# EAGLE design p2m-001 (EAGLE 9.6.2)
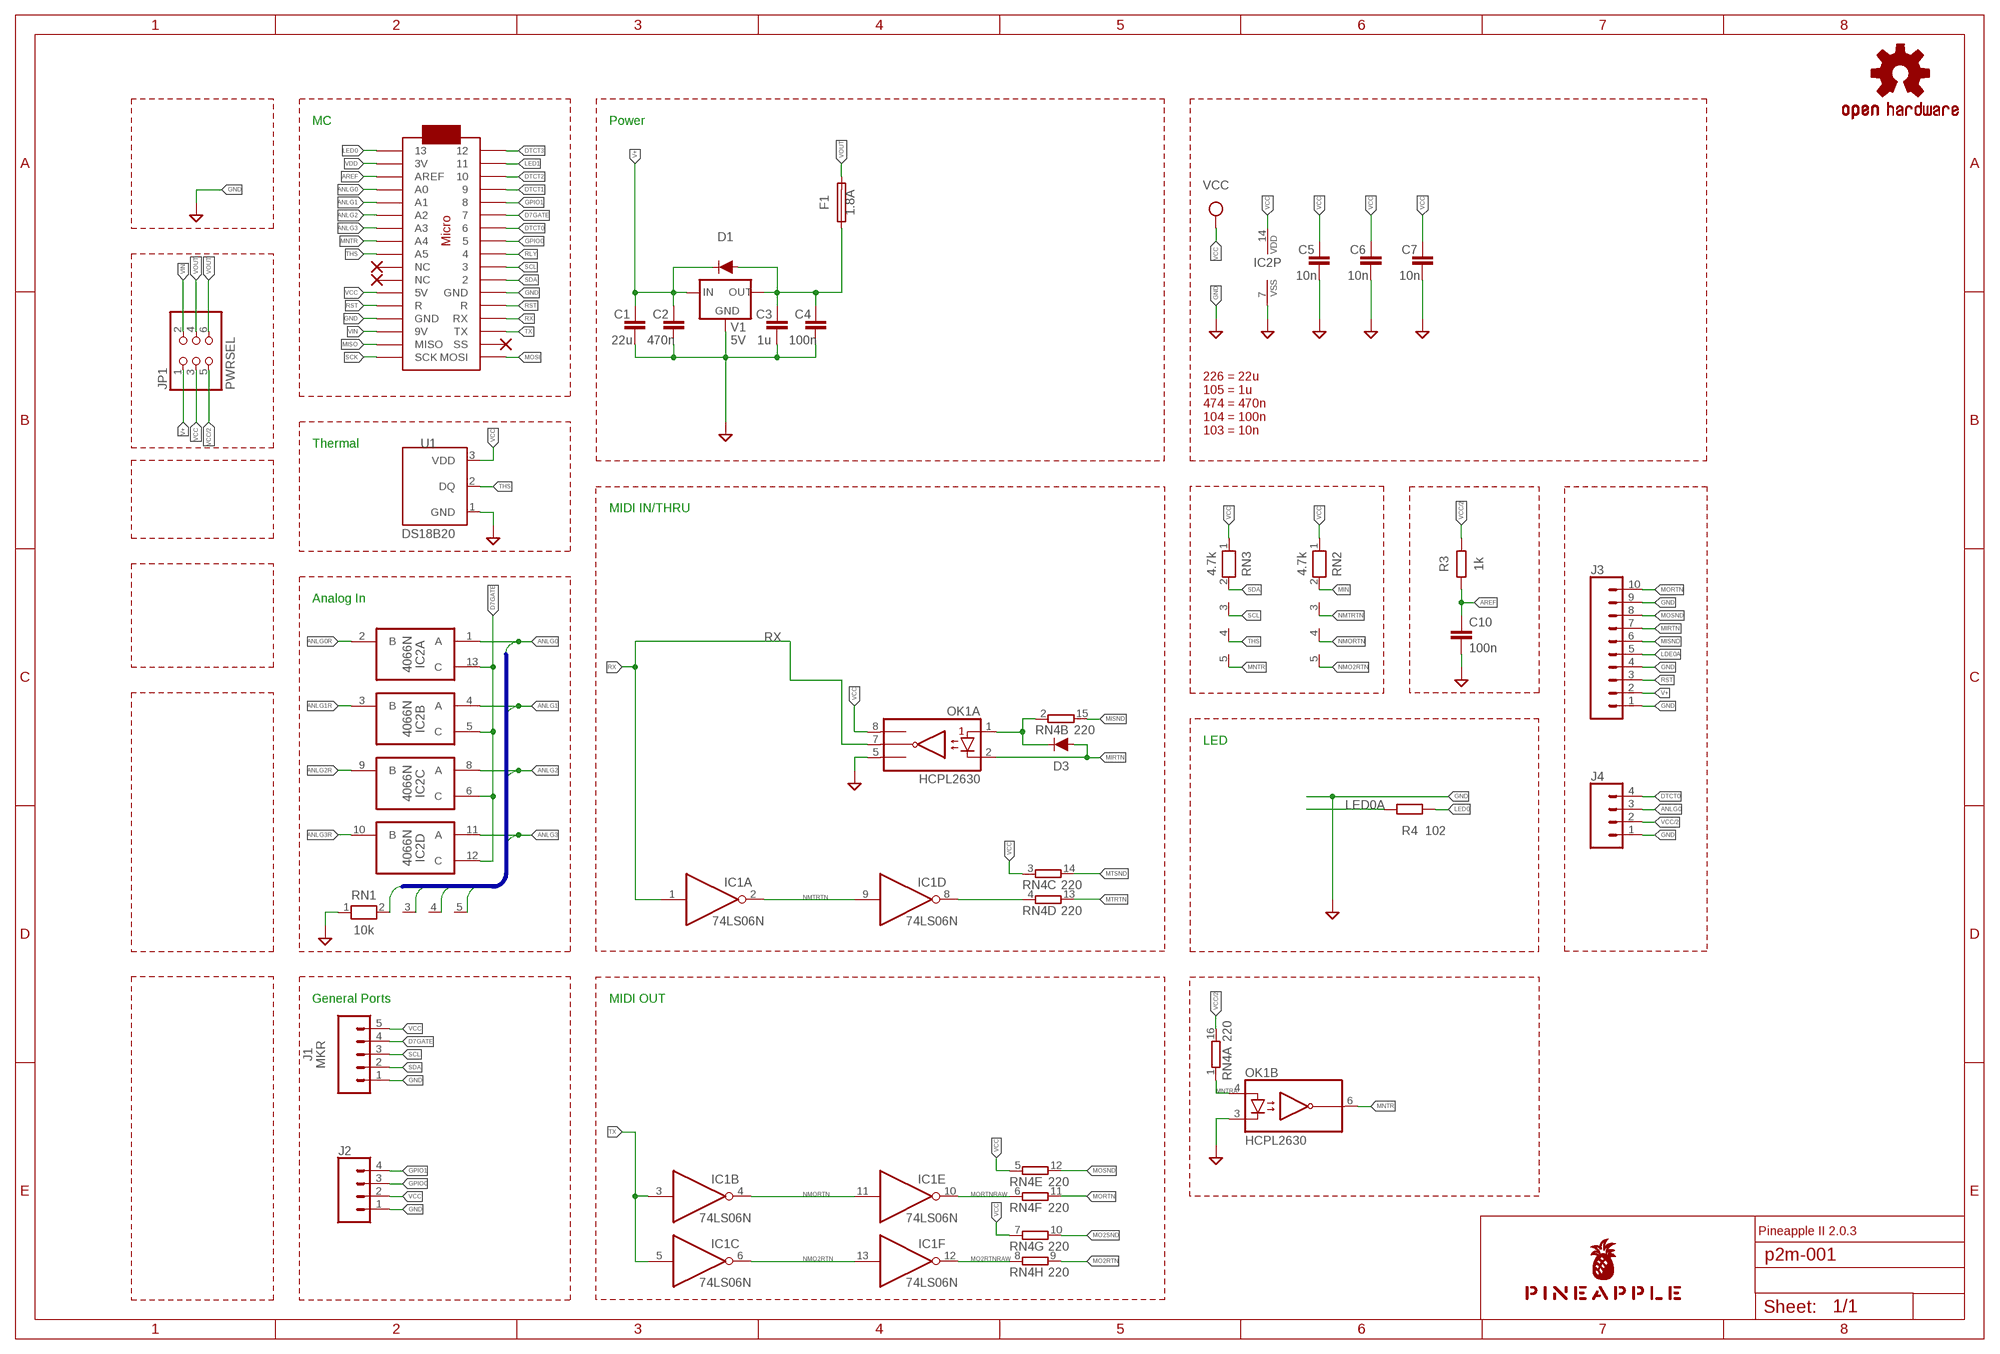
[diagram p0: schematic, sheet 1]

## Parts
C1  22u  C-EU025-050X050  [C025-050X050]
C2  470n  C-EU050-024X044  [C050-024X044]
C3  1u  C-EU050-024X044  [C050-024X044]
C4  100n  C-EU025-024X044  [C025-024X044]
C5  10n  C-EU025-024X044  [C025-024X044]
C6  10n  C-EU025-024X044  [C025-024X044]
C7  10n  C-EU025-024X044  [C025-024X044]
C10  100n  C-EU025-024X044  [C025-024X044]
D1  DIODE-1N4148  [DIODE-1N4148]
D3  DIODE-1N4148  [DIODE-1N4148]
F1  1.8A  TE5  [TE5]
IC1  74LS06N  [DIL14]
IC2  4066N  [DIL14]
J1  MKR  CONN_05JST  [JST-5-PTH]
J2  CONN_04JST-PTH  [JST-4-PTH]
J3  CONN_102MM  [1X10-2MM]
J4  CONN_04JST-PTH  [JST-4-PTH]
JP1  PWRSEL  PINHD-2X3  [2X03]
LOGO1  OSHW-LOGOS-COPPER  [OSHW-LOGO-S_COPPER]
MC1  ARDUINOMICRO  [ARDUINOMICRO]
OK1  HCPL2630  [DIL08]
R3  1k  R-EU_0204/5  [0204/5]
R4  102  R-EU_0204/5  [0204/5]
RN1  10k  RN04  [RN-5]
RN2  4.7k  RN04  [RN-5]
RN3  4.7k  RN04  [RN-5]
RN4  220  8R-N  [DIL16]
U1  DS18B20  [TO-92-AMMO]
U$1  PINEAPPLE450_SILK  [PINEAPPLE450_SILK]
V1  5V  78XXL  [78XXL]

## Nets
ANLG0 [analog]: IC2.1(A:A) J4.3 MC1.P$31(A0) RN1.2
ANLG0R [analog]: IC2.2(A:B)
ANLG1 [analog]: IC2.4(B:A) MC1.P$30(A1) RN1.3
ANLG1R [analog]: IC2.3(B:B)
ANLG2 [analog]: IC2.8(C:A) MC1.P$29(A2) RN1.4
ANLG2R [analog]: IC2.9(C:B)
ANLG3 [analog]: IC2.11(D:A) MC1.P$28(A3) RN1.5
ANLG3R [analog]: IC2.10(D:B)
AREF: C10.1 MC1.P$32(AREF) R3.1
D7GATE: IC2.5(B:C) IC2.6(C:C) IC2.12(D:C) IC2.13(A:C) J1.4 MC1.P$6
DTCT0: J4.4 MC1.P$7
DTCT1: MC1.P$4
DTCT2: MC1.P$3
DTCT3: MC1.P$1
GND [gnd]: C1.2 C2.2 C3.2 C4.2 C5.2 C6.2 C7.2 C10.2 IC2.7(P:VSS) J1.1 J2.1 J3.1 J3.4 J3.9 J4.1 MC1.P$12(GND) MC1.P$21(GND) OK1.3(B:C2) OK1.5(A:GND) RN1.1 U1.1(GND) V1.GND
GPIO0: J2.3 MC1.P$8
GPIO1: J2.4 MC1.P$5
LDE0A: J3.5
LED0: MC1.P$34 R4.2
LED0A: R4.1
LED1: MC1.P$2
MIDIINSND: D3.C OK1.1(A:A1) RN4.2
MIN: RN2.2
MIRTN [external]: D3.A J3.7 OK1.2(A:C1)
MISND [external]: J3.6 RN4.15
MISO: MC1.P$19(MISO)
MNTR: MC1.P$27(A4) OK1.6(B:VO2) RN3.5
MNTRA: OK1.4(B:A2) RN4.1
MO2RTN: RN4.9
MO2RTNRAW: IC1.12(F:O) RN4.8
MO2SND: RN4.10
MORTN: J3.10 RN4.11
MORTNRAW: IC1.10(E:O) RN4.6
MOSI: MC1.P$17(MOSI)
MOSND: J3.8 RN4.12
MTRTN: RN4.13
MTRTNRAW: IC1.8(D:O) RN4.4
MTSND: RN4.14
NMO2RTN: IC1.6(C:O) IC1.13(F:I) RN2.5
NMORTN: IC1.4(B:O) IC1.11(E:I) RN2.4
NMTRTN: IC1.2(A:O) IC1.9(D:I) RN2.3
RLY: MC1.P$9
RST: J3.3 MC1.P$13(R) MC1.P$22(R)
RX: IC1.1(A:I) MC1.P$14(RX) OK1.7(A:VO1)
SCK: MC1.P$18(SCK)
SCL: J1.3 MC1.P$10 RN3.3
SDA: J1.2 MC1.P$11 RN3.2
THS: MC1.P$26(A5) RN3.4 U1.2(DQ)
TX: IC1.3(B:I) IC1.5(C:I) MC1.P$15(TX)
V+ [superpower]: C1.1 C2.1 D1.C J3.2 JP1.1 V1.IN
VCC [power]: C5.1 C6.1 C7.1 IC2.14(P:VDD) J1.5 J2.2 JP1.3 MC1.P$23(5V) OK1.8(A:VCC) RN2.1 RN3.1 RN4.3 RN4.5 RN4.7 U1.3(VDD)
VCC/2 [superpower]: J4.2 JP1.5 R3.2 RN4.16
VDD [power]: MC1.P$33(3V)
VIN [superpower]: JP1.2 MC1.P$20(9V)
VOUT [superpower]: F1.2 JP1.4 JP1.6
VOUTRAW [superpower]: C3.1 C4.1 D1.A F1.1 V1.OUT
Unconnected: MC1.P$16(SS) MC1.P$24(NC) MC1.P$25(NC)

## Buses
ANLG[0..3]

## Notes on the sheet
- MC | Power
- 226 = 22u
  105 = 1u
  474 = 470n
  104 = 100n
  103 = 10n
- Thermal
- MIDI IN/THRU
- Analog In
- LED
- General Ports | MIDI OUT
- Pineapple II 2.0.3

## Power pins joined to a net without a drawn wire
GND: IC1.7(P:GND)
VCC: IC1.14(P:VCC)

## Library data of the parts
C1-C4 C10 = rcl:C-EU: CAPACITOR, European symbol; SPICEPREFIX: C
C5-C7 = resistor:C-EU: CAPACITOR, European symbol
D1 D3 = SparkFun-DiscreteSemi:DIODE: Diode These are standard reverse protection diodes and small signal diodes. SparkFun Products: SparkFun SparkPunk Sound Kit <https://www.sparkfun.com/products/11177> SparkFun ESP8266 Thing <https://www.sparkfun.com/products/13231>; PROD_ID: DIO-08378; VALUE: 200mA/100V/1V
F1 = fuse:TE5: FUSE Wickmann; OC_FARNELL: unknown; OC_NEWARK: unknown
IC1 = 74xx-us:74*06: Hex INVERTER, open collector high-voltage output
IC2 = 40xx:4066: Quad bilateral ANALOG SWITCH
J1 = SparkFun-Connectors:CONN_05: Multi connection point. Often used as Generic Header-pin footprint for 0.1 inch spaced/style header connections On any of the 0.1 inch spaced packages, you can populate with these: Break Away Headers - Straight <https://www.sparkfun.com/products/116> (PRT-00116) Break Away Male Headers - Right Angle <https://www.sparkfun.com/products/553> (PRT-00553) Female Headers <https://www.sparkfun.com/products/115> (PRT-00115) Break Away Headers - Machine Pin <https://www.sparkfun.com/products/117> (PRT-00117) Break Away Female Headers - Swiss Machine Pin <https://www.sparkfun.com/products/743> (PRT-00743) For SCREWTERMINALS and SPRING TERMINALS visit here: Screw Terimnals on SparkFun.com <https://www.sparkfun.com/search/results?term=Screw+Terminals> (5mm/3.5mm/2.54mm spacing) This device is also useful as a general connection point to wire up your design to another part of your project. Our various solder wires solder well into these plated through hole pads. Hook-Up Wire - Assortment (Stranded, 22 AWG) <https://www.sparkfun.com/products/11375> (PRT-11375) Hook-Up Wire - Assortment (Solid Core, 22 AWG) <https://www.sparkfun.com/products/11367> (PRT-11367) View the entire wire category on our website here <https://www.sparkfun.com/categories/141> Special notes: Molex polarized connector foot print use with SKU : PRT-08231 with associated crimp pins and housings. 1MM SMD Version SKU: PRT-10208; SF_ID: PRT-09917
J2 J4 = SparkFun-Connectors:CONN_04: Multi connection point. Often used as Generic Header-pin footprint for 0.1 inch spaced/style header connections On any of the 0.1 inch spaced packages, you can populate with these: Break Away Headers - Straight <https://www.sparkfun.com/products/116> (PRT-00116) Break Away Male Headers - Right Angle <https://www.sparkfun.com/products/553> (PRT-00553) Female Headers <https://www.sparkfun.com/products/115> (PRT-00115) Break Away Headers - Machine Pin <https://www.sparkfun.com/products/117> (PRT-00117) Break Away Female Headers - Swiss Machine Pin <https://www.sparkfun.com/products/743> (PRT-00743) For SCREWTERMINALS and SPRING TERMINALS visit here: Screw Terimnals on SparkFun.com <https://www.sparkfun.com/search/results?term=Screw+Terminals> (5mm/3.5mm/2.54mm spacing) This device is also useful as a general connection point to wire up your design to another part of your project. Our various solder wires solder well into these plated through hole pads. Hook-Up Wire - Assortment (Stranded, 22 AWG) <https://www.sparkfun.com/products/11375> (PRT-11375) Hook-Up Wire - Assortment (Solid Core, 22 AWG) <https://www.sparkfun.com/products/11367> (PRT-11367) View the entire wire category on our website here <https://www.sparkfun.com/categories/141> Special notes: Molex polarized connector foot print use with SKU : PRT-08231 with associated crimp pins and housings. 1MM SMD Version SKU: PRT-10208; PROD_ID: WIRE-13531; SF_ID: PRT-09916
J3 = SparkFun-Connectors:CONN_10: Multi connection point. Often used as Generic Header-pin footprint for 0.1 inch spaced/style header connections On any of the 0.1 inch spaced packages, you can populate with these: Break Away Headers - Straight <https://www.sparkfun.com/products/116> (PRT-00116) Break Away Male Headers - Right Angle <https://www.sparkfun.com/products/553> (PRT-00553) Female Headers <https://www.sparkfun.com/products/115> (PRT-00115) Break Away Headers - Machine Pin <https://www.sparkfun.com/products/117> (PRT-00117) Break Away Female Headers - Swiss Machine Pin <https://www.sparkfun.com/products/743> (PRT-00743) Arduino Stackable Header - 10 Pin <https://www.sparkfun.com/products/11376> (PRT-11376) For SCREWTERMINALS and SPRING TERMINALS visit here: Screw Terimnals on SparkFun.com <https://www.sparkfun.com/search/results?term=Screw+Terminals> (5mm/3.5mm/2.54mm spacing) This device is also useful as a general connection point to wire up your design to another part of your project. Our various solder wires solder well into these plated through hole pads. Hook-Up Wire - Assortment (Stranded, 22 AWG) <https://www.sparkfun.com/products/11375> (PRT-11375) Hook-Up Wire - Assortment (Solid Core, 22 AWG) <https://www.sparkfun.com/products/11367> (PRT-11367) View the entire wire category on our website here <https://www.sparkfun.com/categories/141> Special notes: Molex polarized connector foot print use with SKU : PRT-08231 with associated crimp pins and housings. 1MM SMD Version SKU: PRT-10208 NOTES ON THE VARIANTS LOCK and LOCK_LONGPADS... This footprint was designed to help hold the alignment of a through-hole component (i.e. 6-pin header) while soldering it into place. You may notice that each hole has been shifted either up or down by 0.005 of an inch from it's more standard position (which is a perfectly straight line). This slight alteration caused the pins (the squares in the middle) to touch the edges of the holes. Because they are alternating, it causes a "brace" to hold the component in place. 0.005 has proven to be the perfect amount of "off-center" position when using our standard breakaway headers. Although looks a little odd when you look at the bare footprint, once you have a header in there, the alteration is very hard to notice. Also,if you push a header all the way into place, it is covered up entirely on the bottom side.; PROD_ID: CONN-08875; SF_ID: PRT-08272
JP1 = pinhead:PINHD-2X3: PIN HEADER
LOGO1 = SparkFun-Aesthetics:OSHW-LOGO: Open-Source Hardware (OSHW) Logo This logo indicates the piece of hardware it is found on incorporates a OSHW license and/or adheres to the definition of open source hardware found here: http://freedomdefined.org/OSHW
MC1 = adafruit:ARDUINOMICRO
OK1 = optocoupler:HCPL2630: HEWLETT PACKARD OPTO COUPLER; MF: AGILENT TECHNOLOGIES; MPN: HCPL-2630-000E; OC_FARNELL: 9994904; OC_NEWARK: 88H7813
R3 R4 = resistor:R-EU_: RESISTOR, European symbol
RN1-RN3 = resistor-net:RN04: RESISTOR NETWORK; OC_FARNELL: unknown; OC_NEWARK: unknown
RN4 = resistor-dil:8R-N: DIL RESISTOR; OC_FARNELL: unknown; OC_NEWARK: unknown
U1 = SparkFun-Sensors:DS18B20: Dallas/Maxim DS18B20 1-Wire Temperature Sensor The DS18B20 reports degrees C with 9 to 12-bit precision, -55C to 125C (+/-0.5C). Each sensor has a unique 64-Bit Serial number etched into it - allows for a huge number of sensors to be used on one data bus. Datasheet <http://datasheets.maximintegrated.com/en/ds/DS18B20.pdf> SparkFun Products One Wire Digital Temperature Sensor - DS18B20 <https://www.sparkfun.com/products/245> (SEN-00245); STORE_ID: SEN-00245
U$1 = pineapple:PINEAPPLE450_SILK
V1 = v-reg:78XXL: VOLTAGE REGULATOR

## Net classes
0 default: width 0.152 mm, drill 0.152 mm, clearance 0.152 mm
1 gnd: width 0.305 mm, drill 0.152 mm, clearance 0.152 mm
2 power: width 0.508 mm, drill 0.152 mm, clearance 0.152 mm
3 analog: width 0.305 mm, drill 0.152 mm, clearance 0.152 mm
4 external: width 0.152 mm, drill 0.152 mm, clearance 0.152 mm
5 superpower: width 1.016 mm, drill 0.152 mm, clearance 0.152 mm

## Board
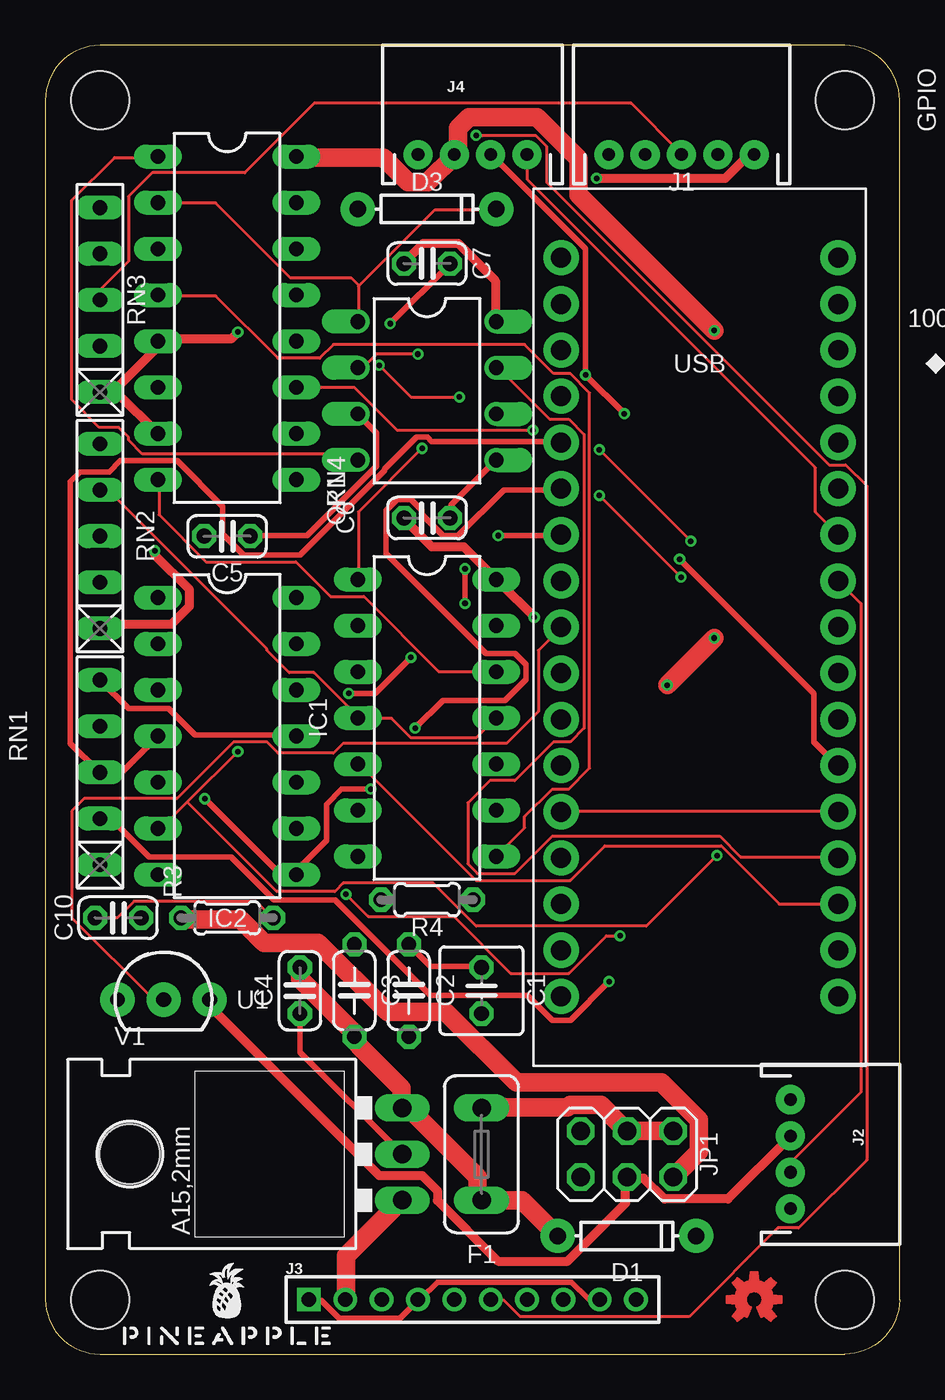
[diagram p1: board, top side]
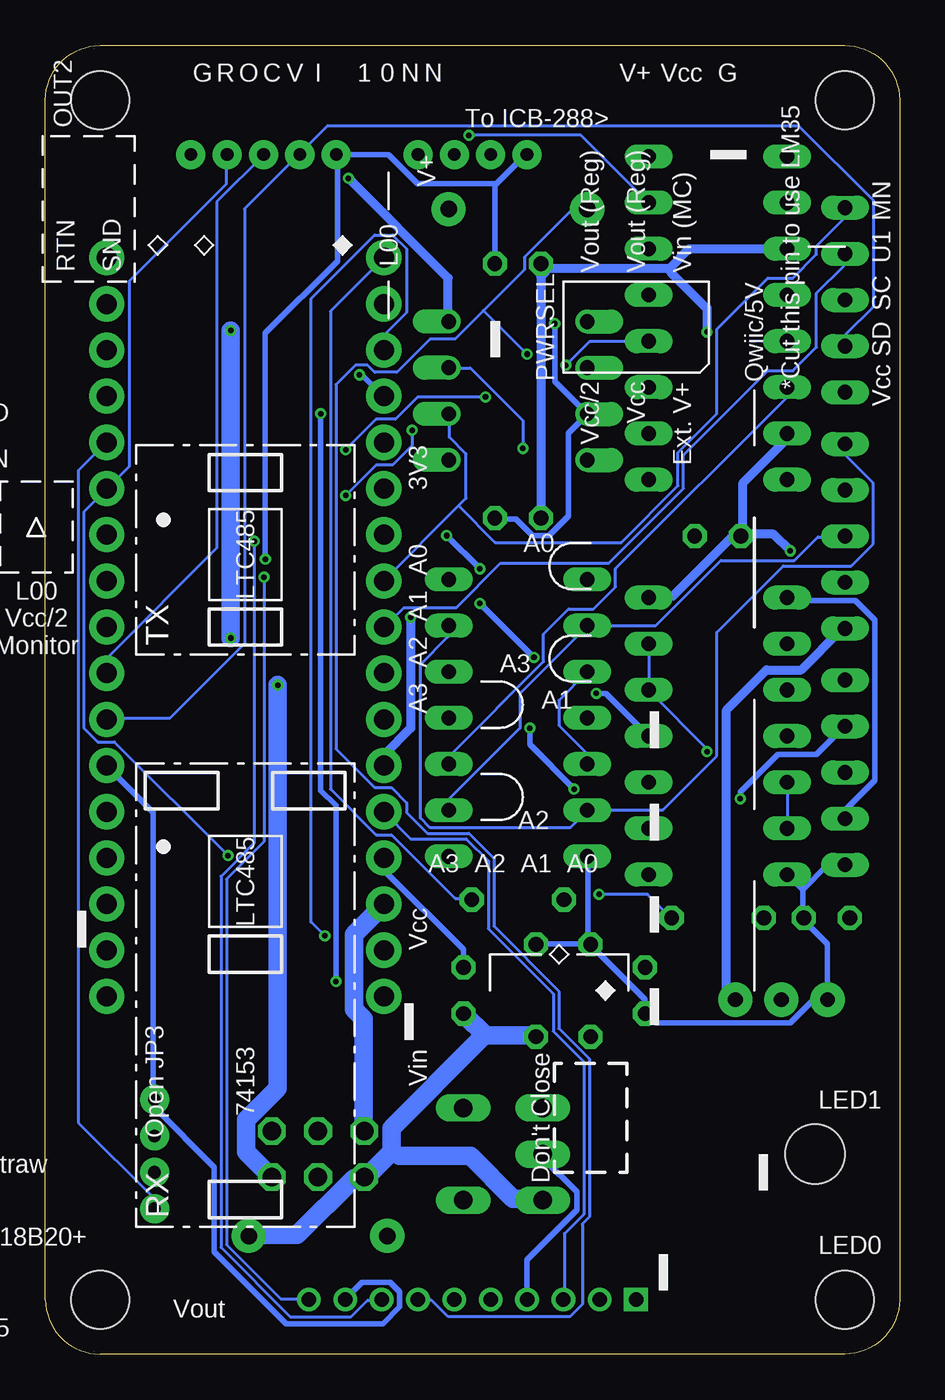
[diagram p2: board, bottom side, seen from below]

Size 47 x 72 mm. Coordinates in mm from the lower left corner, seen from the top.
Outline: 3,0 44,0 arc90 47,3 47,69 arc90 44,72 3,72 arc90 0,69 0,3 arc90 3,0
Copper layers (1*16): Top 0.035mm / dielectric 1.5mm / Bottom 0.035mm
Design rules "SeeedStudio_2layer_DRU_no_angle_20140221": minimum track width 6mil, minimum drill 12mil, track to track 6mil, track to pad 6mil, pad to pad 6mil, via to via 6mil, smd to smd 0mil, copper to edge 10mil, drill to drill 10mil, minimum pad ring 10mil, minimum via ring 6mil, stop-mask expansion 2mil, vias tented up to drill 100mil, thermal gap 10mil
Holes 3.2 mm at 3,3 3,69 44,69 44,3
tRestrict: area 0.8,66.8 to 5.2,71.2; area 0.8,0.8 to 5.2,5.2; area 41.8,66.8 to 46.2,71.2; area 41.8,0.8 to 46.2,5.2; area 0,71 to 47,72; area 0,0 to 47,1; area 0,0 to 1,72; area 46,0 to 47,72
bRestrict: area 0.8,0.8 to 5.2,5.2; area 0.8,66.8 to 5.2,71.2; area 41.8,66.8 to 46.2,71.2; area 41.8,0.8 to 46.2,5.2; area 0,71 to 47,72; area 0,0 to 47,1; area 0,0 to 1,72; area 46,0 to 47,72

### Footprints (pad centres in the part's own frame; a part is rotated, then mirrored left to right if it is on the bottom)
C025-050X050 = drill 0.813 octagon: 1 -1.27,0; 2 1.27,0
C050-024X044 = drill 0.813 octagon: 1 -2.54,0; 2 2.54,0
C025-024X044 = drill 0.813 octagon: 1 -1.27,0; 2 1.27,0
DIODE-1N4148 = drill 0.9 pad 1.88: A -3.81,0; C 3.81,0
TE5 = drill 1.016 long: 1 -2.54,0; 2 2.54,0
DIL14 = drill 0.813 long: 1 -7.62,-3.81; 2 -5.08,-3.81; 3 -2.54,-3.81; 4 0,-3.81; 5 2.54,-3.81; 6 5.08,-3.81; 7 7.62,-3.81; 8 7.62,3.81; 9 5.08,3.81; 10 2.54,3.81; 11 0,3.81; 12 -2.54,3.81; 13 -5.08,3.81; 14 -7.62,3.81
JST-5-PTH = drill 0.7 pad 1.6: 1 -4,0; 2 -2,0; 3 0,0; 4 2,0; 5 4,0
JST-4-PTH = drill 0.7 pad 1.6: 1 -3,0; 2 -1,0; 3 1,0; 4 3,0
1X10-2MM = drill 0.8 square: 1 0,0 | drill 0.8: 2 2,0; 3 4,0; 4 6,0; 5 8,0; 6 10,0; 7 12,0; 8 14,0; 9 16,0; 10 18,0
2X03 = drill 1.016 octagon: 1 -2.54,-1.27; 2 -2.54,1.27; 3 0,-1.27; 4 0,1.27; 5 2.54,-1.27; 6 2.54,1.27
ARDUINOMICRO = drill 1.1 pad 1.93: P$1 -20.32,7.62; P$2 -17.78,7.62; P$3 -15.24,7.62; P$4 -12.7,7.62; P$5 -10.16,7.62; P$6 -7.62,7.62; P$7 -5.08,7.62; P$8 -2.54,7.62; P$9 0,7.62; P$10 2.54,7.62; P$11 5.08,7.62; P$12 12.7,-7.62; P$13 10.16,-7.62; P$14 12.7,7.62; P$15 15.24,7.62; P$16 17.78,7.62; P$17 20.32,7.62; P$18 20.32,-7.62; P$19 17.78,-7.62; P$20 15.24,-7.62; P$21 7.62,7.62; P$22 10.16,7.62; P$23 7.62,-7.62; P$24 5.08,-7.62; P$25 2.54,-7.62; P$26 0,-7.62; P$27 -2.54,-7.62; P$28 -5.08,-7.62; P$29 -7.62,-7.62; P$30 -10.16,-7.62; P$31 -12.7,-7.62; P$32 -15.24,-7.62; P$33 -17.78,-7.62; P$34 -20.32,-7.62
DIL08 = drill 0.813 offset: 1 -3.81,-3.81; 2 -1.27,-3.81; 3 1.27,-3.81; 4 3.81,-3.81; 5 3.81,3.81; 6 1.27,3.81; 7 -1.27,3.81; 8 -3.81,3.81
0204/5 = drill 0.813 octagon: 1 -2.54,0; 2 2.54,0
RN-5 = drill 0.813 long: 1 -5.08,0; 2 -2.54,0; 3 0,0; 4 2.54,0; 5 5.08,0
DIL16 = drill 0.813 long: 1 -8.89,-3.81; 2 -6.35,-3.81; 3 -3.81,-3.81; 4 -1.27,-3.81; 5 1.27,-3.81; 6 3.81,-3.81; 7 6.35,-3.81; 8 8.89,-3.81; 9 8.89,3.81; 10 6.35,3.81; 11 3.81,3.81; 12 1.27,3.81; 13 -1.27,3.81; 14 -3.81,3.81; 15 -6.35,3.81; 16 -8.89,3.81
TO-92-AMMO = drill 0.813 pad 1.88: 1 -2.54,0; 2 0,0; 3 2.54,0
78XXL = drill 1.016 long: GND 0,-3.81; IN -2.54,-3.81; OUT 2.54,-3.81 | hole 3.302: 0,11.176

### Placement (x,y rotation side)
C1  24,20 90 top
C2  20,20 90 top
C3  17,20 90 top
C4  14,20 270 top
C5  10,45 0 top
C6  21,46 0 top
C7  21,60 0 top
C10  4,24 0 top
D1  32,6.5 0 top
D3  21,63 0 top
F1  24,11 90 top
IC1  21,35 270 top
IC2  10,34 270 top
J1  35,66 0 top
J2  41,11 270 top
J3  14.5,3 0 top
J4  23.5,66 0 top
JP1  32,11 0 top
LOGO1  39,3 0 top
MC1  36,40 270 top
OK1  21,53 270 top
R3  10,24 180 top
R4  21,25 0 top
RN1  3,32 90 top
RN2  3,45 90 top
RN3  3,58 90 top
RN4  10,57 270 top
U1  6.5,19.5 0 top
U$1  10,0.5 0 top
V1  15.82,11 90 top

### Tracks (layer width: path | path; a pad name or v marks a point on that pad's centre or on a via)
ANLG0  (via drill 0.3)
  Top 0.305: J4.3 24.54,65.99 29.72,60.81 v29.72,53.87 v31.85,51.74 | v31.01,20.5 28.88,18.36 27.89,18.36 26.52,19.74 21.18,19.74 15.93,24.99 12.57,24.99 10.21,27.36 5.71,27.36 3.66,29.41 3.05,29.41 RN1.2
  Bottom 0.305: RN1.2 2.97,29.49 2.97,29.95 1.37,31.55 1.37,40.39 2.44,41.45 6.02,41.45 6.17,41.6 IC2.1 | v29.72,53.87 29.57,53.87 28.42,52.73 MC1.P$31 | v31.01,20.5 31.01,30.18 31.85,31.01 v31.85,51.74
ANLG1
  Top 0.305: IC2.4 6.17,33.98 4.19,32 3.05,32 RN1.3 2.9,32.08 1.37,33.6 1.37,48.01 1.91,48.54 3.5,48.54 4.12,49.15 7.24,49.15 9.75,46.63 9.75,45.11 10.9,43.97 14.02,43.97 18.67,48.62 18.67,48.69 20.42,50.44 21.03,50.44 21.26,50.22 28.35,50.22 MC1.P$30
ANLG2  (via drill 0.3)
  Top 0.305: v8.76,30.56 12.88,26.44 13.79,26.44 IC2.8 13.79,26.59 15.47,28.27 15.47,30.25 16.31,31.09 v17.91,31.09 | v20.34,34.44 21.87,35.97 25.3,35.97 26.44,37.11 26.44,37.95 25.83,38.56 24.23,38.56 18.75,44.04 18.75,46.41 19.36,47.02 20.12,47.02 20.73,46.41 20.73,46.18 21.87,45.03 22.71,45.03 25.22,47.55 28.35,47.55 MC1.P$29
  Bottom 0.305: v8.76,30.56 8.76,30.94 6.71,32.99 4.57,32.99 3.05,34.52 RN1.4 | v20.34,34.44 20.34,33.53 v17.91,31.09
ANLG3  (via drill 0.3)
  Top 0.305: IC2.11 13.79,34.06 8.23,34.06 6.78,35.51 4.57,35.51 3.05,37.03 RN1.5 | v24.92,45.03 28.35,45.03 MC1.P$28 | v23.09,41.3 v23.09,43.2 | v20.12,38.33 18.14,36.35 v16.69,36.35
  Bottom 0.305: v23.09,43.2 v24.92,45.03 | v20.12,38.33 v23.09,41.3 | v16.69,36.35 16.15,36.35 13.87,34.06 IC2.11
AREF  (via drill 0.3)
  Top 0.152: C10.1 2.74,24 3.96,24 4.88,24.92 11.58,24.92 12.5,24 R3.1 | v31.62,23.01 30.86,23.01 28.8,20.95 25.6,20.95 22.48,24.08 17.75,24.08 v16.54,25.3
  Bottom 0.152: v31.62,23.01 32.38,23.77 32.38,58.06 28.88,61.57 27.89,61.57 27.13,60.81 27.13,57.3 28.35,56.08 28.35,55.24 MC1.P$32 | v16.54,25.3 13.87,25.3 12.57,24 R3.1
D7GATE  (via drill 0.3)
  Top 0.152: v10.59,33.15 7.81,30.37 | 7.81,30.37 6.4,28.96 6.25,28.96 IC2.6 | 7.81,30.37 12.72,25.45 15.93,25.45 16.38,25.91 21.34,25.91 23.7,23.55 33.07,23.55 v36.96,27.43
  Bottom 0.152: IC2.6 6.17,28.96 6.17,31.39 IC2.5 | IC2.13 13.79,39.01 13.79,36.58 IC2.12 13.79,36.5 10.59,33.3 v10.59,33.15 | J1.4 37.03,65.99 37.03,64.39 42.37,59.05 42.37,48.84 43.59,47.62 MC1.P$6 43.66,47.55 44.88,46.33 44.88,34.44 44.12,33.68 43.2,33.68 v36.96,27.43
DTCT0
  Top 0.152: J4.4 26.52,65.99 26.52,64.62 42.37,48.77 42.37,46.33 43.59,45.11 MC1.P$7
GND  (via drill 0.3)
  Top 0.305: C6.2 22.33,46.02 22.33,46.71 24.77,49.15 OK1.5 | C5.2 11.28,45.03 14.4,45.03 18.21,48.84 18.21,50.67 17.22,51.66 OK1.3 | v18.97,56.69 22.25,59.97 C7.2 | C1.2 23.93,21.34 21.18,21.34 20.04,22.48 C2.2 | J3.1 14.55,2.97 15.16,2.97 16.15,1.98 19.51,1.98 20.5,2.97 J3.4 20.65,3.05 21.57,3.96 28.96,3.96 29.87,3.05 30.48,3.05 J3.9 | C4.2 14.02,18.67 14.02,16.61 19.58,11.05 V1.GND | v34.9,43.74 42.29,36.35 42.29,33.68 43.59,32.38 MC1.P$21
  Bottom 0.305: 22.25,64.31 22.25,60.05 C7.2 | 22.25,64.31 20.57,65.99 J4.1 | 22.25,64.31 22.33,64.39 26.52,64.39 28.12,65.99 30.94,65.99 J1.1 30.94,65.84 30.94,60.12 34.9,56.16 v34.9,43.74 | C6.2 22.25,45.95 21.11,45.95 20.19,45.03 19.28,45.03 18.21,46.1 18.21,50.67 17.22,51.66 OK1.3 17.3,51.82 18.97,53.49 v18.97,56.69 | 5.33,25.53 5.33,24 C10.2 5.26,23.85 3.96,22.55 U1.1 4.12,19.51 4.72,19.51 6.02,18.21 13.41,18.21 13.87,18.67 C4.2 14.02,18.75 14.02,19.51 16.99,22.48 C3.2 | 5.33,25.53 6.17,26.36 IC2.7 | 5.33,25.53 3.96,26.9 3.05,26.9 RN1.1 | C2.2 19.96,22.55 17.14,22.55 C3.2 | IC1.7 17.14,27.36 17.14,22.71 C3.2 | MC1.P$12 28.35,27.28 28.35,26.59 24,22.25 24,21.34 C1.2 | MC1.P$21 43.59,32.31 41.07,29.79 41.07,14.02 J2.1 41,13.87 41,13.56 37.72,10.29 37.72,5.64 33.76,1.68 28.42,1.68 27.51,2.59 27.51,3.43 28.04,3.96 29.57,3.96 30.48,3.05 J3.9 | V1.GND 19.58,10.97 19.58,10.74 17.75,8.91 17.75,7.92 20.5,5.18 20.5,3.05 J3.4
GPIO0
  Top 0.152: J2.3 41.07,10.06 41.07,10.59 44.88,14.4 44.88,41.3 43.66,42.52 MC1.P$8
GPIO1
  Bottom 0.152: J2.4 41.07,8 41.07,8.61 45.19,12.72 45.19,48.62 43.66,50.14 MC1.P$5
LED0
  Bottom 0.152: R4.2 23.55,25.07 24.46,25.07 27.96,28.57 28.8,28.57 31.32,31.09 31.32,57.38 28.42,60.27 MC1.P$34
MIDIINSND
  Top 0.152: 17.26,58.79 21.41,62.94 24.77,62.94 D3.C | 17.26,58.79 17.22,58.75 17.22,56.84 OK1.1 | 17.26,58.79 16.84,59.21 13.49,59.21 9.37,63.32 6.25,63.32 RN4.2
MIRTN  (via drill 0.3)
  Top 0.152: v20.5,55.02 18.21,55.02 17.53,54.33 17.22,54.33 OK1.2
  Bottom 0.152: 22.9,57.42 20.65,59.66 20.65,60.35 18.06,62.94 17.22,62.94 D3.A | 22.9,57.42 24.46,55.85 25.83,55.85 27.66,54.03 28.88,54.03 29.26,54.41 29.95,54.41 31.01,53.34 31.01,33.3 28.88,31.17 27.96,31.17 27.13,30.33 27.13,29.79 25.98,28.65 23.7,28.65 22.33,27.28 22.33,23.55 18.75,19.96 18.75,17.91 17.07,16.23 17.07,7.54 17.45,7.16 17.45,2.74 18.14,2.06 24.84,2.06 25.76,2.97 26.44,2.97 J3.7 | 22.9,57.42 v20.5,55.02
MISND  (via drill 0.3)
  Top 0.152: v23.7,67.06 26.98,67.06 27.58,66.45 27.58,64.47 43.13,48.92 44.04,48.92 45.19,47.78 45.19,10.67 41.45,6.93 40.31,6.93 35.43,2.06 26.14,2.06 25.22,2.97 24.54,2.97 J3.6
  Bottom 0.152: v23.7,67.06 17.53,67.06 13.87,63.4 RN4.15
MNTR
  Bottom 0.152: 24.27,46.67 28.35,42.6 MC1.P$27 | 24.27,46.67 23.85,47.09 23.85,49.53 24.77,50.44 24.77,51.66 OK1.6 | 24.27,46.67 22.25,44.65 15.32,44.65 12.19,47.78 12.19,49.61 10.06,51.74 10.06,56.39 7.24,59.21 5.87,59.21 4.57,60.5 4.57,60.96 3.05,62.48 3.05,63.02 RN3.5
MNTRA
  Top 0.152: RN4.1 6.17,65.84 3.81,65.84 1.45,63.48 1.45,52.5 2.97,50.98 4.04,50.98 4.57,50.44 4.57,50.29 5.33,49.53 16.84,49.53 17.14,49.23 OK1.4
MO2RTNRAW
  Top 0.152: IC1.12 24.77,37.57 21.64,37.57 17.53,41.68 15.7,41.68 13.79,43.59 8.84,43.59 6.25,46.18 6.25,48.08 RN4.8
MORTN  (via drill 0.3)
  Top 0.152: v30.48,47.24 v34.98,42.75 | v26.82,50.83 19.36,50.83 16.99,53.19 13.87,53.19 RN4.11
  Bottom 0.152: v34.98,42.75 34.98,28.19 37.03,26.14 37.03,6.02 34.06,3.05 32.54,3.05 J3.10 | v30.48,47.24 28.8,48.92 27.89,48.92 26.82,49.99 v26.82,50.83
MORTNRAW
  Bottom 0.152: RN4.6 6.25,53.19 6.25,52.58 15.62,43.2 15.62,42.22 16.84,41 18.21,41 19.58,39.62 19.58,38.1 24.77,32.92 24.77,32.46 IC1.10
MOSND  (via drill 0.3)
  Top 0.152: v30.48,49.76 v35.51,44.73 | v22.78,52.65 20.12,52.65 v18.36,54.41
  Bottom 0.152: v35.51,44.73 35.51,28.12 37.34,26.29 37.34,5.87 33.53,2.06 30.18,2.06 29.26,2.97 28.57,2.97 J3.8 | v30.48,49.76 28.8,51.44 27.74,51.44 26.52,52.65 v22.78,52.65 | v18.36,54.41 17.07,55.7 13.87,55.7 RN4.12
MTRTNRAW
  Top 0.152: RN4.4 6.25,58.22 9.37,58.22 12.8,54.79 15.09,54.79 15.85,55.55 26.36,55.55 27.96,53.95 28.88,53.95 29.95,52.88 29.95,32.23 28.8,31.09 27.89,31.09 26.36,29.57 26.36,28.96 24.84,27.43 IC1.8
NMO2RTN
  Bottom 0.152: RN2.5 2.97,50.06 2.97,49.45 1.45,47.93 1.45,44.58 2.67,43.36 6.4,43.36 10.06,39.7 10.06,32.92 13.03,29.95 17.14,29.95 IC1.6 17.22,29.87 18.14,28.96 25.83,28.96 26.36,29.49 26.36,37.95 24.84,39.47 24.84,40.01 IC1.13
NMORTN
  Top 0.152: IC1.11 24.77,34.98 23.7,33.91 20.12,33.91 19.05,34.98 17.22,34.98 IC1.4 17.22,35.05 14.78,37.49 13.41,37.49 12.19,38.71 12.19,38.79 3.5,47.47 3.05,47.47 RN2.4
NMTRTN
  Bottom 0.152: IC1.9 24.77,29.95 24.77,30.56 20.88,34.44 20.88,36.35 17.22,40.01 IC1.2 17.14,40.08 13.41,40.08 9.83,43.66 5.79,43.66 4.5,44.96 3.05,44.96 RN2.3
RST
  Top 0.152: MC1.P$22 43.59,29.87 28.42,29.87 MC1.P$13
  Bottom 0.152: J3.3 18.44,3.05 18.44,6.63 17.37,7.7 17.37,16.08 19.05,17.75 19.05,19.81 22.63,23.39 22.63,27.13 23.85,28.35 26.9,28.35 28.35,29.79 MC1.P$13
RX  (via drill 0.3)
  Top 0.152: v20.73,49.84 17.22,46.33 17.22,42.67 IC1.1 | MC1.P$14 43.59,27.36 38.25,27.36 37.11,28.5 27.89,28.5 25.83,26.44 23.77,26.44 23.24,26.98 23.24,30.33 24.46,31.55 25.83,31.55 27.96,33.68 28.88,33.68 29.64,34.44 29.64,50.6 28.8,51.44 27.74,51.44 24.84,54.33 OK1.7
  Bottom 0.152: v20.73,49.84 20.73,51.36 23.62,54.25 24.77,54.25 OK1.7
SCL
  Top 0.152: RN3.3 3.05,58.06 3.05,58.6 4.57,60.12 4.57,63.7 5.87,65 10.97,65 14.78,68.81 32.23,68.81 34.98,66.06 J1.3
  Bottom 0.152: MC1.P$10 43.59,37.49 43.59,38.33 37.57,44.35 37.57,63.4 34.98,65.99 J1.3
SDA
  Bottom 0.152: RN3.2 2.97,55.47 2.97,56.08 1.45,57.61 1.45,63.48 5.56,67.59 31.47,67.59 32.99,66.06 J1.2 33.07,65.99 36.04,63.02 36.04,39.09 40.16,34.98 43.59,34.98 MC1.P$11
THS
  Top 0.152: U1.2 6.48,19.51 5.94,19.51 1.45,24 1.45,29.87 2.13,30.56 7.24,30.56 10.36,33.68 12.19,33.68 12.8,33.07 15.85,33.07 16.38,33.6 25.38,33.6 27.13,35.36 27.13,38.71 28.35,39.93 MC1.P$26
  Bottom 0.152: RN3.4 3.05,60.5 3.05,59.89 4.57,58.37 4.57,55.4 5.87,54.1 7.24,54.1 11.89,49.45 11.89,47.62 16,43.51 21.95,43.51 24.38,41.07 27.28,41.07 28.35,40.01 MC1.P$26
TX
  Top 0.152: MC1.P$15 43.59,24.77 40.39,24.77 37.19,27.96 30.79,27.96 28.88,26.06 23.7,26.06 17.37,32.38 17.22,32.38 IC1.5
  Bottom 0.152: IC1.5 17.22,32.46 17.22,33.07 18.75,34.59 18.75,35.97 17.22,37.49 IC1.3
V+
  Top 1.016: J3.2 16.54,3.05 16.54,5.41 19.58,8.46 V1.IN
  Bottom 1.016: 22.78,17.53 20.04,17.53 C2.1 | 22.78,17.53 23.93,18.67 C1.1 | D1.C 35.74,6.55 33.15,6.55 30.02,9.68 29.49,9.68 JP1.1 29.03,10.06 27.96,11.12 | 27.96,11.12 27.96,12.42 23.16,17.22 22.78,17.53 | V1.IN 19.66,8.53 21.26,8.53 23.62,10.9 27.51,10.9 27.96,11.12
VCC  (via drill 0.3)
  Top 0.508: RN4.7 6.17,50.67 3.96,52.88 3.05,52.88 RN3.1 3.89,53.11 6.17,55.4 6.17,55.7 RN4.5 6.4,55.85 10.21,55.85 v10.59,56.24 | C6.1 19.74,45.95 21.26,44.42 23.01,44.42 24.77,42.67 IC1.14 24.99,42.44 v26.9,40.54 | OK1.8 24.77,56.84 24.77,59.05 22.71,61.11 20.8,61.11 19.74,60.05 C7.1 | v30.33,64.69 37.41,64.69 38.71,65.99 38.94,65.99 J1.5 | J2.2 41,11.96 37.57,8.53 34.06,8.53 32.92,9.68 32,9.68 JP1.3 31.93,9.45 31.93,8.31 28.73,5.11 24.92,5.11 21.57,8.46 21.57,8.99 20.73,9.83 18.36,9.83 9.07,19.13 9.07,19.43 U1.3 | v6.02,44.2 6.02,43.97 7.92,42.06 7.92,41.15 6.93,40.16 3.28,40.16 3.05,39.93 RN2.1
  Bottom 0.508: IC2.14 13.79,41.68 12.5,41.68 9.22,44.96 8.76,44.96 C5.1 | RN4.7 6.25,50.6 6.25,50.29 8.61,47.93 8.61,45.19 C5.1 | v26.9,40.54 26.9,34.44 28.35,32.99 28.35,32.38 MC1.P$23 | 12.65,59.74 11.58,60.81 6.25,60.81 RN4.3 | 12.65,59.74 19.43,59.74 19.66,59.97 C7.1 19.51,59.51 19.74,59.28 19.74,46.02 C6.1 | v30.33,64.69 24.84,59.21 24.84,56.84 OK1.8 | v10.59,56.24 10.59,57.53 12.57,59.51 12.65,59.74 | RN2.1 3.05,39.85 3.2,39.85 5.41,37.64 7.32,37.64 9.53,35.43 9.53,19.96 9.07,19.51 U1.3 | v6.02,44.2 6.93,45.11 8.38,45.11 C5.1
VCC/2  (via drill 0.3)
  Top 1.016: RN4.16 13.87,65.84 18.59,65.84 19.96,64.47 21.03,64.47 22.55,65.99 J4.2 22.71,66.45 22.71,67.44 23.32,68.05 27.05,68.05 29.34,65.76 29.34,63.78 v36.8,56.31 | R3.2 7.47,23.93 10.74,23.93 12.04,22.63 15.01,22.63 18.82,18.82 22.02,18.82 25.91,14.94 33.91,14.94 35.97,12.88 35.97,11.12 34.59,9.75 JP1.5 | v34.21,36.8 v36.8,39.4
  Bottom 1.016: v36.8,39.4 v36.8,56.31 | v34.21,36.8 34.21,14.63 35.97,12.88 35.97,11.12 34.59,9.75 JP1.5
VIN
  Bottom 1.016: JP1.2 29.49,12.34 29.49,18.44 30.02,18.97 30.02,23.09 28.42,24.69 MC1.P$20
VOUT
  Top 1.016: JP1.6 34.52,12.27 JP1.4 31.62,12.65 30.56,13.72 28.88,13.72 28.73,13.56 24,13.56 F1.2
VOUTRAW
  Top 1.016: D1.A 28.12,6.55 26.21,8.46 F1.1 23.77,8.91 23.77,9.75 20.12,13.41 V1.OUT 19.58,13.56 19.58,14.63 17.22,16.99 C3.1 16.99,17.53 16.99,17.68 14.02,20.65 14.02,21.26 C4.1

### Text on the board
tNames: GPIO (5V) | GPIO | Pineapple IIm | 0.0.1-X | GND | MNTR | 1k | MKR | 100n | 4.7k | USB | 221 | 102 | MNTR | 102 | TLP2630 | 74LS06 | 4066B | BackPort II | LED | 100n | Arduino Micro | 100n | 47k | 470n | 10k | 4.7k | 5V1.5A | 1k | 1A | C1815 | 1u | MC1 | Pineapple Computer (2022) | DS18B20+
bNames: G | Vcc | V+ | N | N | 0 | 1 | I | V | C | O | R | G | G | V | G0 | G1 | To ICB-288> | OUT2 | V+ | GND | MN | GND | JP3 | U1 | *Cut this pin to use LM35 | L00 | SND | RTN | SDA | Vin (MC) | Vout (Reg) | Vout (Reg) | SCL | SC | D7 | SD | PWRSEL | Close | Vcc | Qwiic/5V | Ext. V+ | Vcc | Vcc/2 | Vcc | SND | 3V3 | RTN | PWRSEL | MIDI / IN | A0 | Dual | A0 | LTC485 | L00 / Vcc/2 / Monitor | A1 | Single | A2 | TX | A3 | A1 | A3 | Arduino | Direct 5V | A2 | MIDI / OUT | A0 | A1 | A2 | A3 | LTC485 | Vcc | Bottom / View | Vcc | Relay | Vin | V+ | 74153 | Open JP3 | NC | LED1 | Don't Close | C | NO | Voutraw | RX | LED0 | You can istall LM35* instead of DS18B20+ | Vout | *Cut pull-up R to install LM35